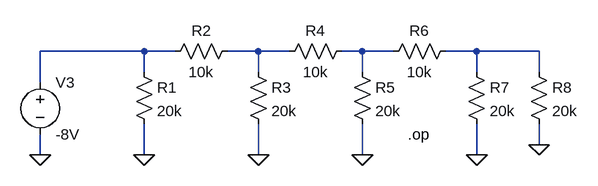
[diagram p0: schematic R-2R-principe.asc]
R-2R-principe.asc, the LTspice schematic file:
Version 4
SHEET 1 936 680
WIRE -720 -112 -832 -112
WIRE -672 -112 -720 -112
WIRE -624 -112 -672 -112
WIRE -512 -112 -544 -112
WIRE -496 -112 -512 -112
WIRE -448 -112 -496 -112
WIRE -352 -112 -368 -112
WIRE -336 -112 -352 -112
WIRE -288 -112 -336 -112
WIRE -192 -112 -208 -112
WIRE -160 -112 -192 -112
WIRE -64 -112 -160 -112
WIRE -672 -80 -672 -112
WIRE -496 -80 -496 -112
WIRE -336 -80 -336 -112
WIRE -160 -80 -160 -112
WIRE -64 -80 -64 -112
WIRE -832 -64 -832 -112
WIRE -64 32 -64 0
WIRE -832 48 -832 16
WIRE -672 48 -672 0
WIRE -496 48 -496 0
WIRE -336 48 -336 0
WIRE -160 48 -160 0
FLAG -832 48 0
FLAG -64 32 0
FLAG -160 48 0
FLAG -336 48 0
FLAG -496 48 0
FLAG -672 48 0
DATAFLAG -720 -112 ""
DATAFLAG -512 -112 ""
DATAFLAG -352 -112 ""
DATAFLAG -192 -112 ""
SYMBOL res -688 -96 R0
SYMATTR InstName R1
SYMATTR Value 20k
SYMBOL res -528 -128 R90
WINDOW 0 0 56 VBottom 0
WINDOW 3 32 56 VTop 0
SYMATTR InstName R2
SYMATTR Value 10k
SYMBOL res -512 -96 R0
SYMATTR InstName R3
SYMATTR Value 20k
SYMBOL res -352 -96 R0
SYMATTR InstName R5
SYMATTR Value 20k
SYMBOL voltage -832 -80 R0
WINDOW 123 0 0 Left 0
WINDOW 39 0 0 Left 0
SYMATTR InstName V3
SYMATTR Value -8V
SYMBOL res -352 -128 R90
WINDOW 0 0 56 VBottom 0
WINDOW 3 32 56 VTop 0
SYMATTR InstName R4
SYMATTR Value 10k
SYMBOL res -192 -128 R90
WINDOW 0 0 56 VBottom 0
WINDOW 3 32 56 VTop 0
SYMATTR InstName R6
SYMATTR Value 10k
SYMBOL res -176 -96 R0
SYMATTR InstName R7
SYMATTR Value 20k
SYMBOL res -80 -96 R0
SYMATTR InstName R8
SYMATTR Value 20k
TEXT -266 16 Left 0 !.op

The netlist it stands for:
* R-2R-principe.asc
R1 N001 0 20k
R2 N002 N001 10k
R3 N002 0 20k
R5 N003 0 20k
V3 N001 0 -8V
R4 N003 N002 10k
R6 N004 N003 10k
R7 N004 0 20k
R8 N004 0 20k
.op
.backanno
.end